# Altium project 243-436_PCB-Support-STM32F407.PrjPcb (part 2 of 2)

## Sheet Alimentation.SchDoc: Alimentation
size Letter; ApprovedBy: kc; Author: CEGEP Limoilou; Organization: Cegep Limoilou; Address1: 1300, 8e Avenue; Address2: Québec, QC; Address3: Canada; Address4: G1J 5L5; SheetNumber: 7; SheetTotal: 11
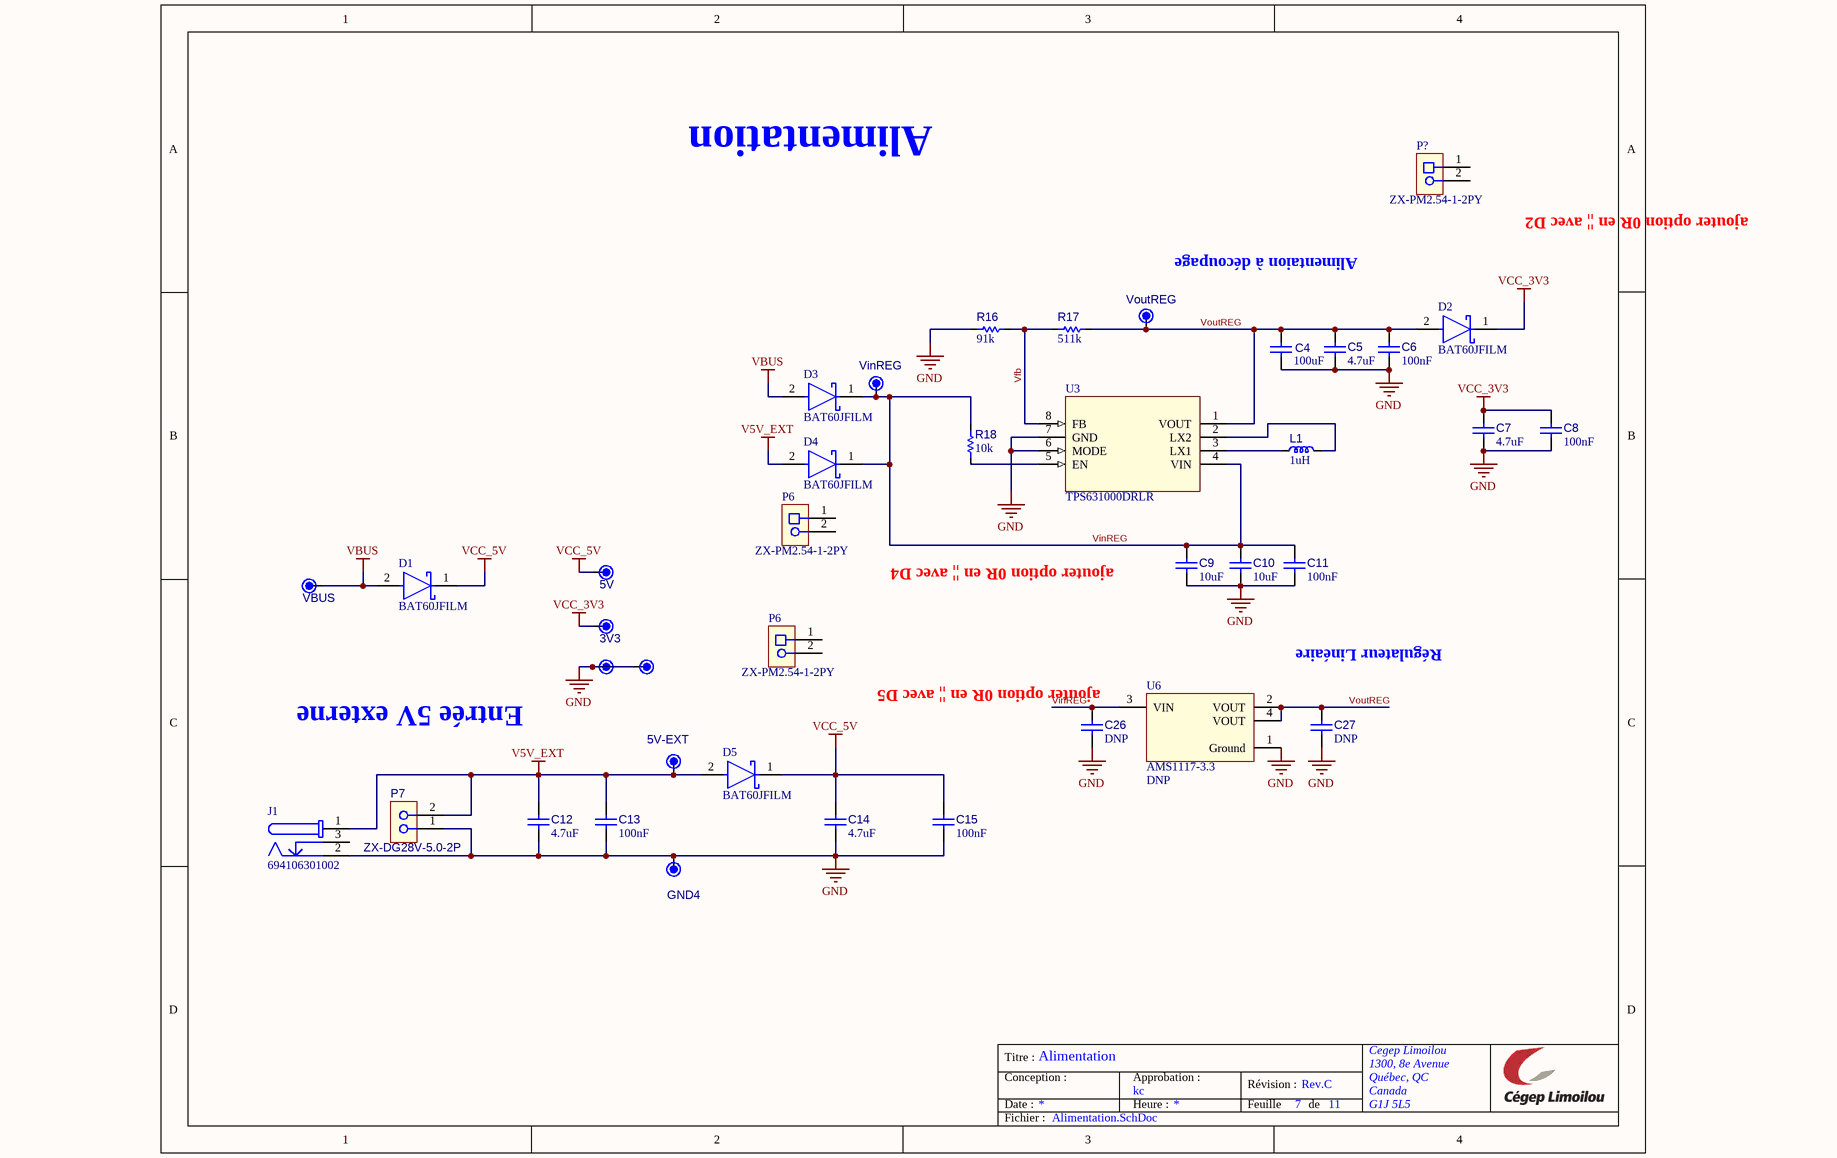
[diagram p10: Alimentation.SchDoc]

### Parts
(Parts that share a designator on the sheet are numbered #1, #2 ... from top to bottom, then left to right.)
3V3#2  DNP  [TP_TH061]  (value not drawn)  (no BOM)
5V#2  DNP  [TP_TH061]  (value not drawn)  (no BOM)
5V-EXT#2  DNP  [TP_TH061]  (value not drawn)  (no BOM)
C4#2  value 100uF  [C_3216[1206]]  (hidden comment: Cap 100uF 1206)
C5#2  value 4.7uF  [C_2012[0805]]  (hidden comment: Cap 4.7uF 0805)
C6#2  value 100nF  [C_1005[0402]]  (hidden comment: Cap 100nF 0402)
C7#2  value 4.7uF  [C_2012[0805]]  (hidden comment: Cap 4.7uF 0805)
C8#2  value 100nF  [C_1005[0402]]  (hidden comment: Cap 100nF 0402)
C9#2  value 10uF  [C_2012[0805]]  (hidden comment: CAP CER 10uF 25V X5R 0805)
C10#2  value 10uF  [C_2012[0805]]  (hidden comment: CAP CER 10uF 25V X5R 0805)
C11#2  value 100nF  [C_1005[0402]]  (hidden comment: Cap 100nF 0402)
C12#2  value 4.7uF  [C_2012[0805]]  (hidden comment: Cap 4.7uF 0805)
C13#2  value 100nF  [C_1005[0402]]  (hidden comment: Cap 100nF 0402)
C14#2  value 4.7uF  [C_2012[0805]]  (hidden comment: Cap 4.7uF 0805)
C15#2  value 100nF  [C_1005[0402]]  (hidden comment: Cap 100nF 0402)
C26#2  value DNP  [C_2012[0805]]  (hidden comment: CAP CER 10uF 25V X5R 0805)  (no BOM)
C27#2  value DNP  [C_2012[0805]]  (hidden comment: CAP CER 10uF 25V X5R 0805)  (no BOM)
D1#2  BAT60JFILM  [SOD323]
D2#2  BAT60JFILM  [SOD323]
D3#2  BAT60JFILM  [SOD323]
D4#2  BAT60JFILM  [SOD323]
D5#2  BAT60JFILM  [SOD323]
GND1#2  GND  [TP_TH061]  (value not drawn)  (no BOM)
GND2#2  GND  [TP_TH061]  (value not drawn)  (no BOM)
GND4#2  GND  [TP_TH061]  (value not drawn)  (no BOM)
J1#2  694106301002  [CONN_DC-JACK_RA]
L1  value 1uH  [L_3030[1212]]  (hidden comment: Ind 1UH 2.75A 51mOHM SMD)
P6#2  ZX-PM2.54-1-2PY  [CONN_SKT_2POS_100MILS_TH]
P6#3  ZX-PM2.54-1-2PY  [CONN_SKT_2POS_100MILS_TH]
P7#2  ZX-DG28V-5.0-2P  [CONN_TERM_BLOCK_2POS_5mm_Model1]
P?  ZX-PM2.54-1-2PY  [CONN_SKT_2POS_100MILS_TH]
R16  value 91k  [R_1005[0402]]  (hidden comment: Res 91k 1% 0402)
R17  value 511k  [R_1005[0402]]  (hidden comment: Res 511k 1% 0402)
R18  value 10k  [R_1005[0402]]  (hidden comment: Res 10k 1% 0402)
U3#2  TPS631000DRLR  [U_SOT583_50P210X120X60-8]
U6#2  AMS1117-3.3  value DNP  [SOT-223]  (no BOM)
VBUS#2  DNP  [TP_TH061]  (value not drawn)  (no BOM)
VinREG  DNP  [TP_TH061]  (value not drawn)  (no BOM)
VoutREG  DNP  [TP_TH061]  (value not drawn)  (no BOM)

### Nets
GND: C4#2.1 C5#2.1 C6#2.1 C7#2.1 C8#2.1 C9#2.1 C10#2.1 C11#2.1 C12#2.1 C13#2.1 C14#2.1 C15#2.1 C26#2.1 C27#2.1 GND1#2.1 GND2#2.1 GND4#2.1 J1#2.2 P7#2.1 R16.1 U3#2.6(MODE) U3#2.7(GND) U6#2.1(Ground)
V5V_EXT: 5V-EXT#2.1 C12#2.2 C13#2.2 D4#2.2(A) D5#2.2(A) J1#2.1 P7#2.2
VBUS: D1#2.2(A) D3#2.2(A) VBUS#2.1
VCC_3V3: 3V3#2.1 C7#2.2 C8#2.2 D2#2.1(K)
VCC_5V: 5V#2.1 C14#2.2 C15#2.2 D1#2.1(K) D5#2.1(K)
Vfb: R16.2 R17.1 U3#2.8(FB)
VinREG: C9#2.2 C10#2.2 C11#2.2 C26#2.2 D3#2.1(K) D4#2.1(K) R18.2 U3#2.4(VIN) U6#2.3(VIN) VinREG.1
VoutREG: C4#2.2 C5#2.2 C6#2.2 C27#2.2 D2#2.2(A) R17.2 U3#2.1(VOUT) U6#2.2(VOUT) U6#2.4(VOUT) VoutREG.1
NetL1_1: L1.1 U3#2.3(LX1)
NetL1_2: L1.2 U3#2.2(LX2)
NetR18_1: R18.1 U3#2.5(EN)

Not connected (* = marked no-connect by the designer): J1#2 3; P6#2 1 2; P6#3 1 2; P? 1 2

### Notes on the sheet
- (near P?) ajouter option 0R en || avec D2
- Alimentaion à découpage
- (near 5V#2) ajouter option 0R en || avec D4
- ajouter option 0R en || avec D5
- Régulateur Linéaire
- Entrée 5V externe
- Titre :
- Conception :
- Date :
- Approbation :
- Heure :
- Révision :
- Feuille
- de
- Fichier :

### Library data of the parts
3V3#2 5V#2 5V-EXT#2 VBUS#2 VinREG VoutREG = TP_TH0.61mm(AWG28): Pad TH 0.61mm diameter (AWG28); Value: DNP; Manufacturer Part Number 1: DNP; Supplier Part Number 1: N/A; Supplier 1: N/A
C4#2 = CAP005: Capacitor type 1; Manufacturer 1: Murata; Manufacturer Part Number 1: GRM31CR61A107MEA8L; LibRef: CAP005; CEGEP: KCOND04SM; Tolerance: 20%; Rated Voltage: 10V; Dielectric: X5R; Supplier 1: LCSC; Supplier Part Number 1: C883598; Mounting Technology: SMT
C5#2 C7#2 C12#2 C14#2 = CAP003: Capacitor type 1; Manufacturer 1: Taiyo Yuden; Manufacturer Part Number 1: TMK212AB7475KG-T; LibRef: CAP003; CEGEP: KCOND02SM; Tolerance: 10%; Rated Voltage: 25V; Dielectric: X7R; Supplier 1: LCSC; Supplier Part Number 1: C163186; Mounting Technology: SMT
C6#2 C8#2 C11#2 C13#2 C15#2 = CAP001: Capacitor type 1; Manufacturer 1: Taiyo Yuden; Manufacturer Part Number 1: UMK105B7104KV-FR; LibRef: CAP001; CEGEP: KCOND01SM; Tolerance: 10%; Rated Voltage: 50V; Dielectric: X7R; Mounting Technology: SMT; Supplier 1: LCSC; Supplier Part Number 1: C2167491
C9#2 C10#2 C26#2 C27#2 = CAP020: Capacitor type 1; Manufacturer 1: Samsung; Manufacturer Part Number 1: CL21A106KAYNNNE; LibRef: CAP020; Tolerance: 10%; Rated Voltage: 25V; Dielectric: X5R; Mounting Technology: SMT; Supplier 1: LCSC; Supplier Part Number 1: C15850
D1#2 D2#2 D3#2 D4#2 D5#2 = D_BAT60: DIODE SCHOTTKY 10V 3A SOD323; Manufacturer 1: ST; Manufacturer Part Number 1: BAT60JFILM; Mounting Technology: SMT; Supplier 1: LCSC; Supplier Part Number 1: C133103
GND1#2 GND2#2 GND4#2 = TP_TH0.61mm(AWG28): as GND3 on sheet PCB-Support-STM32F407; Manufacturer Part Number 1: DNP; Supplier Part Number 1: N/A; Supplier 1: N/A
J1#2 = CONN-DC-JACK-2MM5: DC Barrel Connector 2.5mm; Manufacturer 1: XKB Connection; Manufacturer Part Number 1: DC-005-5A-2.5; Mounting Technology: TH; Supplier 1: LCSC; Supplier Part Number 1: C381115
L1 = IND001: Inductor type 1; Manufacturer 1: Murata Electronics; Manufacturer Part Number 1: LQH3NPN1R0MMEL; LibRef: IND001; CEGEP: KPTSO09; Tolerance: 0,2; DCR: 0.025R; Saturation Current: 2.3A; Supplier 1: LCSC; Supplier Part Number 1: C703777; Mounting Technology: SMT
P6#2 P6#3 P? = CONN-100MIL-SKT-01X02: CONN SOCKET 2pins single row , 100mils TH; Manufacturer 1: Megastar; Manufacturer Part Number 1: ZX-PM2.54-1-2PY; Mounting Technology: TH; Supplier 1: LCSC; Supplier Part Number 1: C7499322; Manufacturer 2: Würth Elektronik; Manufacturer Part Number 2: 61300211121
P7#2 = CONN-5MM-2POS-TERM-BLOCK: CONN TERM BLOCK 2POS 5mm pitch; Manufacturer 1: Megastar; Code CEGEP: CONWECO0002; Supplier 1: LCSC; Supplier Part Number 1: C49022995; Manufacturer Part Number 1: ZX-DG28V-5.0-2P; Mounting Technology: TH; Manufacturer 2: Weidmüller - Phoenix Contact; Manufacturer Part Number 2: 1760510000 - 1890963
R16 = RES011: Resistor type 1; Manufacturer 1: Yageo; Manufacturer Part Number 1: RC0402FR-0791KL; LibRef: RES011; Code CEGEP: RES91KSM; Puissance: 1/16W; Max Working Voltage: 50V; Tolerance: 1%; Mounting Technology: SMT; Supplier 1: LCSC; Supplier Part Number 1: C327323
R17 = RES012: Resistor type 1; Manufacturer 1: Yageo; Manufacturer Part Number 1: RC0402FR-07511KL; LibRef: RES012; Code CEGEP: RES511KSM; Puissance: 1/16W; Max Working Voltage: 50V; Tolerance: 1%; Mounting Technology: SMT; Supplier 1: LCSC; Supplier Part Number 1: C163461
R18 = RES003: Resistor type 1; Manufacturer 1: Vishay; Manufacturer Part Number 1: CR0402F1002T1LF; LibRef: RES003; Puissance: 1/16W; Max Working Voltage: 50V; Tolerance: 1%; Mounting Technology: SMT; Supplier 1: Digikey; Supplier Part Number 1: 541-10.0KLCT-ND
U3#2 = U_TPS631000DRLR: buck-boost converter 1.5-A output current,; Manufacturer 1: Texas Instruments; Manufacturer Part Number 1: TPS631000DRLR; Supplier 1: LCSC; Supplier 2: Digikey; Supplier Part Number 1: C5219190; Supplier Part Number 2: 296-TPS631000DRLRCT-ND; Mounting Technology: SMT
U6#2 = U_AMS1117-3.3: LDO Voltage Regulators 1A, 3.3V; Manufacturer 1: UMW; Manufacturer Part Number 1: AMS1117-3.3; Mounting Technology: SMT; Manufacturer 2: Advanced Monolithic Systems; Manufacturer Part Number 2: AMS1117-3.3; Supplier 1: LCSC; Supplier 2: LCSC; Supplier Part Number 1: C347222; Supplier Part Number 2: C6186

## Nets that join several sheets
GND: PCB-Support-STM32F407 (8 pins), STM32Disc1-Interface (14 pins), MikroBus-Connecteur 2 (C16B.1 C17B.1 MIKROBUS1B.8 MIKROBUS1B.9), MikroBus-Connecteur 1 (C16A.1 C17A.1 MIKROBUS1A.8 MIKROBUS1A.9), USB (34 pins), CAN-Driver (5 pins), PMOD-Connecteur (8 pins), Affichage-LCD (C25#2.1 R24.1 VR1.3), LCD-Connecteur-KS0108 (5 pins), LCD-Connecteur-ST7920 (5 pins), Affichage-LCD/Level-Translator1 (C23A.1 C24A.1 U5A.11), Affichage-LCD/Level-Translator2 (9 pins), Alimentation (23 pins)
V5V_EXT: USB (7 pins), Alimentation (7 pins)
VBUS: USB (10 pins), Alimentation (D1#2.2 D3#2.2 VBUS#2.1)
VCC_3V3: STM32Disc1-Interface (P5.5 P5.6 R10#2.1 R11.1), MikroBus-Connecteur 2 (C16B.2 MIKROBUS1B.7), MikroBus-Connecteur 1 (C16A.2 MIKROBUS1A.7), USB (3V3#1.1 C10#1.2 C11#1.2 D3#1.1), CAN-Driver (C25#1.2 C26#1.2 U6#1.3), PMOD-Connecteur (8 pins), Affichage-LCD/Level-Translator1 (C23A.2 U5A.2 U5A.10), Affichage-LCD/Level-Translator2 (C23B.2 U5B.2 U5B.10), Alimentation (3V3#2.1 C7#2.2 C8#2.2 D2#2.1)
VCC_5V: PCB-Support-STM32F407 (P1.2), STM32Disc1-Interface (P5.3 P5.4), MikroBus-Connecteur 2 (C17B.2 MIKROBUS1B.10), MikroBus-Connecteur 1 (C17A.2 MIKROBUS1A.10), USB (5 pins), Affichage-LCD (C25#2.2 R21.2 R22.1 R23.2), LCD-Connecteur-KS0108 (P8#2.1), LCD-Connecteur-ST7920 (P15.2), Affichage-LCD/Level-Translator1 (C24A.2 U5A.19), Affichage-LCD/Level-Translator2 (C24B.2 U5B.19), Alimentation (5 pins)
MB1-RX: PCB-Support-STM32F407 (R3.1), MikroBus-Connecteur 1 (MIKROBUS1A.14)
MB1-TX: PCB-Support-STM32F407 (R4.1), MikroBus-Connecteur 1 (MIKROBUS1A.13)
MB2-RX: PCB-Support-STM32F407 (R1.1), MikroBus-Connecteur 2 (MIKROBUS1B.14)
MB2-TX: PCB-Support-STM32F407 (R2.1), MikroBus-Connecteur 2 (MIKROBUS1B.13)
NetP8#2_3: Affichage-LCD (VR1.2), LCD-Connecteur-KS0108 (P8#2.3), LCD-Connecteur-ST7920 (P15.3)
NetP8#2_4: LCD-Connecteur-KS0108 (P8#2.4), LCD-Connecteur-ST7920 (P15.7), Affichage-LCD/Level-Translator1 (U5A.20)
NetP8#2_5: LCD-Connecteur-KS0108 (P8#2.5), LCD-Connecteur-ST7920 (P15.8), Affichage-LCD/Level-Translator1 (U5A.18)
NetP8#2_6: LCD-Connecteur-KS0108 (P8#2.6), LCD-Connecteur-ST7920 (P15.9), Affichage-LCD/Level-Translator1 (U5A.17)
NetP8#2_7: LCD-Connecteur-KS0108 (P8#2.7), LCD-Connecteur-ST7920 (P15.10), Affichage-LCD/Level-Translator1 (U5A.16)
NetP8#2_8: LCD-Connecteur-KS0108 (P8#2.8), LCD-Connecteur-ST7920 (P15.11), Affichage-LCD/Level-Translator1 (U5A.15)
NetP8#2_9: LCD-Connecteur-KS0108 (P8#2.9), LCD-Connecteur-ST7920 (P15.12), Affichage-LCD/Level-Translator1 (U5A.14)
NetP8#2_10: LCD-Connecteur-KS0108 (P8#2.10), LCD-Connecteur-ST7920 (P15.13), Affichage-LCD/Level-Translator1 (U5A.13)
NetP8#2_11: LCD-Connecteur-KS0108 (P8#2.11), LCD-Connecteur-ST7920 (P15.14), Affichage-LCD/Level-Translator1 (U5A.12)
NetP8#2_12: LCD-Connecteur-KS0108 (P8#2.12), LCD-Connecteur-ST7920 (P15.16), Affichage-LCD/Level-Translator2 (U5B.20)
NetP8#2_13: Affichage-LCD (R23.1 R24.2), LCD-Connecteur-KS0108 (P8#2.13), LCD-Connecteur-ST7920 (P15.15), Affichage-LCD/Level-Translator2 (U5B.18)
NetP8#2_14: Affichage-LCD (R21.1), LCD-Connecteur-KS0108 (P8#2.14), LCD-Connecteur-ST7920 (P15.17)
NetP8#2_15: LCD-Connecteur-KS0108 (P8#2.15), LCD-Connecteur-ST7920 (P15.5), Affichage-LCD/Level-Translator2 (U5B.17)
NetP8#2_16: LCD-Connecteur-KS0108 (P8#2.16), LCD-Connecteur-ST7920 (P15.4), Affichage-LCD/Level-Translator2 (U5B.16)
NetP8#2_17: LCD-Connecteur-KS0108 (P8#2.17), LCD-Connecteur-ST7920 (P15.6), Affichage-LCD/Level-Translator2 (U5B.15)
NetP8#2_18: Affichage-LCD (VR1.1), LCD-Connecteur-KS0108 (P8#2.18), LCD-Connecteur-ST7920 (P15.18)
NetP8#2_19: Affichage-LCD (R22.2), LCD-Connecteur-KS0108 (P8#2.19), LCD-Connecteur-ST7920 (P15.19)
PA1/TIM-2/5: STM32Disc1-Interface (P4.11), MikroBus-Connecteur 2 (MIKROBUS1B.16)
PA2/USART2-TX: PCB-Support-STM32F407 (P1.5 R5.2 R8.2), STM32Disc1-Interface (P4.14)
PA3/USART2-RX: PCB-Support-STM32F407 (R6.2 R7.1 R9.2 R10#1.2), STM32Disc1-Interface (P4.13)
PA5/SPI1-CLK: STM32Disc1-Interface (P4.15), PMOD-Connecteur (P8#1.4)
PA6/SPI1-MISO: STM32Disc1-Interface (P4.18), PMOD-Connecteur (P8#1.3)
PA7/SPI1-MOSI: STM32Disc1-Interface (P4.17), PMOD-Connecteur (P8#1.2)
PA8/I2C3-SCL: STM32Disc1-Interface (P5.43), MikroBus-Connecteur 1 (MIKROBUS1A.12), PMOD-Connecteur (P11.3)
PA15/D3: STM32Disc1-Interface (P5.40), PMOD-Connecteur (P7#1.4)
PB0/D1: STM32Disc1-Interface (P4.22), PMOD-Connecteur (P9.4)
PB1/TIM-3/8: STM32Disc1-Interface (P4.21), MikroBus-Connecteur 1 (MIKROBUS1A.16)
PB5/D0: STM32Disc1-Interface (P5.26), PMOD-Connecteur (P7#1.1)
PB6/I2C1-SCL: STM32Disc1-Interface (P5.23), MikroBus-Connecteur 2 (MIKROBUS1B.12)
PB7/D1: STM32Disc1-Interface (P5.24), PMOD-Connecteur (P7#1.2)
PB8/CS0: STM32Disc1-Interface (P5.19), Affichage-LCD/Level-Translator2 (U5B.6)
PB9/I2C1-SDA: STM32Disc1-Interface (P5.20), MikroBus-Connecteur 2 (MIKROBUS1B.11)
PB11/UART3-RX: PCB-Support-STM32F407 (R1.2 R3.2), STM32Disc1-Interface (P4.35)
PB12/CS: STM32Disc1-Interface (P4.36), MikroBus-Connecteur 2 (MIKROBUS1B.3)
PB13/SPI2-SCK: STM32Disc1-Interface (P4.37), MikroBus-Connecteur 2 (MIKROBUS1B.4), MikroBus-Connecteur 1 (MIKROBUS1A.4)
PB14/D2: STM32Disc1-Interface (P4.38), PMOD-Connecteur (P11.1)
PB15/SPI2-MOSI: STM32Disc1-Interface (P4.39), MikroBus-Connecteur 2 (MIKROBUS1B.6), MikroBus-Connecteur 1 (MIKROBUS1A.6)
PC1/ADC123-IN11: STM32Disc1-Interface (P4.7), MikroBus-Connecteur 2 (MIKROBUS1B.1)
PC2/SPI2-MISO: STM32Disc1-Interface (P4.10), MikroBus-Connecteur 2 (MIKROBUS1B.5), MikroBus-Connecteur 1 (MIKROBUS1A.5)
PC4/D0: STM32Disc1-Interface (P4.20), PMOD-Connecteur (P9.1)
PC5/ADC12-IN15: STM32Disc1-Interface (P4.19), MikroBus-Connecteur 1 (MIKROBUS1A.1)
PC6/UART6-TX/TIM-3: PCB-Support-STM32F407 (TX6.1), STM32Disc1-Interface (P5.47)
PC8/D3: STM32Disc1-Interface (P5.45), PMOD-Connecteur (P11.2)
PC9/I2C3-SDA: STM32Disc1-Interface (P5.46), MikroBus-Connecteur 1 (MIKROBUS1A.11), PMOD-Connecteur (P11.4)
PC11/D2: STM32Disc1-Interface (P5.38), PMOD-Connecteur (P7#1.3)
PD0/CAN-RX: STM32Disc1-Interface (P5.36), CAN-Driver (U6#1.4)
PD1/CAN-TX: STM32Disc1-Interface (P5.33), CAN-Driver (U6#1.1)
PD2/INT: STM32Disc1-Interface (P5.34), MikroBus-Connecteur 1 (MIKROBUS1A.15)
PD7/A0: STM32Disc1-Interface (P5.27), Affichage-LCD/Level-Translator2 (U5B.1)
PD8/UART3-TX: PCB-Support-STM32F407 (R2.2 R4.2), STM32Disc1-Interface (P4.40)
PD9/A1: STM32Disc1-Interface (P4.41), Affichage-LCD/Level-Translator2 (U5B.3)
PD10/A2: STM32Disc1-Interface (P4.42), Affichage-LCD/Level-Translator2 (U5B.4)
PD11/A3: STM32Disc1-Interface (P4.43), Affichage-LCD/Level-Translator2 (U5B.5)
PD12: STM32Disc1-Interface (P4.44), PMOD-Connecteur (P10.2)
PD13: STM32Disc1-Interface (P4.45), PMOD-Connecteur (P10.1)
PD14: STM32Disc1-Interface (P4.46), PMOD-Connecteur (P10.4)
PD15: STM32Disc1-Interface (P4.47), PMOD-Connecteur (P10.3)
PE0/CS_B: STM32Disc1-Interface (P5.17), PMOD-Connecteur (P8#1.1)
PE2/RST: STM32Disc1-Interface (P5.15), MikroBus-Connecteur 2 (MIKROBUS1B.2)
PE4/RST: STM32Disc1-Interface (P5.13), MikroBus-Connecteur 1 (MIKROBUS1A.2)
PE5/CS: STM32Disc1-Interface (P5.14), MikroBus-Connecteur 1 (MIKROBUS1A.3)
PE7/INT: STM32Disc1-Interface (P4.25), MikroBus-Connecteur 2 (MIKROBUS1B.15)
PE8/D0: STM32Disc1-Interface (P4.26), Affichage-LCD/Level-Translator1 (U5A.1)
PE9/D1: STM32Disc1-Interface (P4.27), Affichage-LCD/Level-Translator1 (U5A.3)
PE10/D2: STM32Disc1-Interface (P4.28), Affichage-LCD/Level-Translator1 (U5A.4)
PE11/D3: STM32Disc1-Interface (P4.29), Affichage-LCD/Level-Translator1 (U5A.5)
PE12/D4: STM32Disc1-Interface (P4.30), Affichage-LCD/Level-Translator1 (U5A.6)
PE13/D5: STM32Disc1-Interface (P4.31), Affichage-LCD/Level-Translator1 (U5A.7)
PE14/D6: STM32Disc1-Interface (P4.32), Affichage-LCD/Level-Translator1 (U5A.8)
PE15/D7: STM32Disc1-Interface (P4.33), Affichage-LCD/Level-Translator1 (U5A.9)
PMOD-RX: PCB-Support-STM32F407 (R6.1), PMOD-Connecteur (P9.3)
PMOD-TX: PCB-Support-STM32F407 (R5.1), PMOD-Connecteur (P9.2)
USB-UART-RX: PCB-Support-STM32F407 (R8.1), USB (U1.9)
USB-UART-TX: PCB-Support-STM32F407 (R10#1.1), USB (U1.8)